# Altium schematic sheet Rotary Encoder.SchDoc: ROTARY ENCODER
size 431 x 279 mm; Date: 02/07/2022; ApprovedBy: RTZ,HYW; CheckedBy: RTZ,HYW; Author: RTZ,HYW; CompanyName: Upenn; DrawnBy: RTZ,HYW; Engineer: RTZ,HYW; Organization: Upenn ESE; Address1: Electrical Engineering; Address2: 200 South 33rd St; Address3: Philadelphia; Address4: PA, 19104; SheetNumber: 6; SheetTotal: 11; ENG_APP_DATE: 02/15/22; DSN_APP_DATE: 02/15/22; CHK_APP_DATE: 02/15/22; DOC_NO_ASSY_DWG: TBD; DOC_NO_FAB_DWG: TBD; PCB_DWG_NO: TBD; Project: SimonSayGame; DESIGN_ITEM: 1.0; CAGE_CODE: TBD; DOC_NO_SCH_DWG: TBD; SCH_SCALE: NA; Time: 13:18
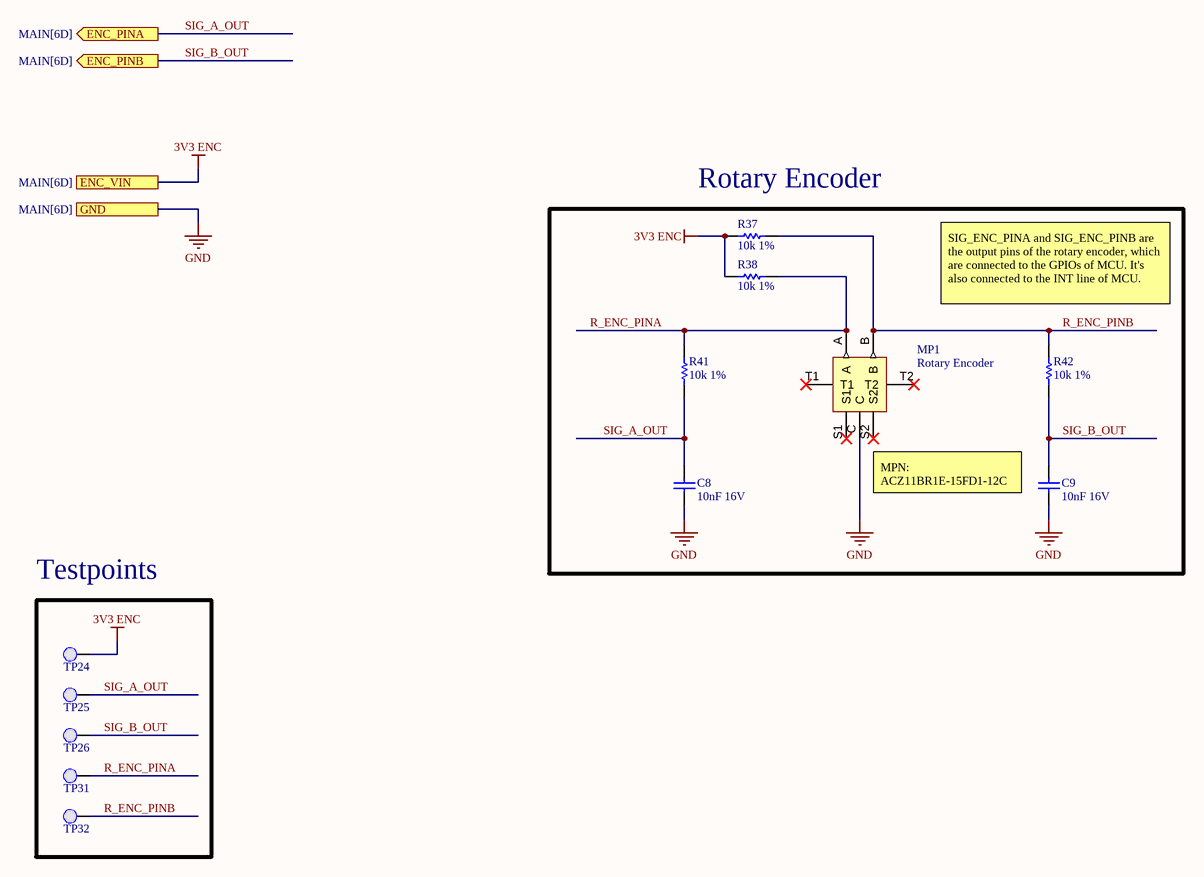
[diagram p0: Rotary Encoder.SchDoc]

## Parts
C8  10nF 16V  [CAPC1608X90]
C9  10nF 16V  [CAPC1608X90]
MP1  Rotary Encoder  [Rotary Encoder]
R37  10k 1%  [RESC1608X55X25ML10T15]
R38  10k 1%  [RESC1608X55X25ML10T15]
R41  10k 1%  [RESC1608X55X25ML10T15]
R42  10k 1%  [RESC1608X55X25ML10T15]
TP24  0.1" Pad  [PCBComponent]  (value not drawn)  (no BOM)
TP25  0.1" Pad  [PCBComponent]  (value not drawn)  (no BOM)
TP26  0.1" Pad  [PCBComponent]  (value not drawn)  (no BOM)
TP31  0.1" Pad  [PCBComponent]  (value not drawn)  (no BOM)
TP32  0.1" Pad  [PCBComponent]  (value not drawn)  (no BOM)

## Blocks framed on the sheet
Rotary Encoder: C8 C9 MP1 R37 R38 R41 R42
Testpoints: TP24-TP26 TP31 TP32

## Ports
ENC_PINA (out, see MAIN[6D]), ENC_PINB (out, see MAIN[6D]), ENC_VIN (see MAIN[6D]), GND (see MAIN[6D])

## Nets
3V3 ENC: R37.2 R38.2 TP24.1(PAD) ; port ENC_VIN
GND: C8.1 C9.1 MP1.C ; port GND
R_ENC_PINA: MP1.A R38.1 R41.2 TP31.1(PAD)
R_ENC_PINB: MP1.B R37.1 R42.2 TP32.1(PAD)
SIG_A_OUT: C8.2 R41.1 TP25.1(PAD) ; port ENC_PINA
SIG_B_OUT: C9.2 R42.1 TP26.1(PAD) ; port ENC_PINB

Not connected (* = marked no-connect by the designer): MP1 S1* S2* T1* T2*

## Notes on the sheet
- SIG_ENC_PINA and SIG_ENC_PINB are the output pins of the rotary encoder, which are connected to the GPIOs of MCU. It's also connected to the INT line of MCU.
  The SIG_A_OUT and SIG_B_OUT can be connected to the oscilloscope for test.
- MPN: ACZ11BR1E-15FD1-12C
- DWG. NO.
- REV.
- SHT.
- THIS DOCUMENT AND THE DATA DISCLOSED HEREIN OR HEREWITH IS THE PROPERTY OF ALTIUM LIMITED AND MAY BE FREELY DISTRIBUTED IN WHOLE. NO RIGHTS ARE RESERVED OR EXPRESS OR IMPLIED WARANTEE GIVEN.
- REVISION
- DESCRIPTION
- DATE
- APPROVED
- ENG:
- APPROVALS
- PROJECT
- DSN:
- CHK:
- REFERENCE DOCUMENTS
- PROJECT REVISION:
- TITLE
- DOCUMENT REVISION:
- DESIGN ITEM:
- BOM:
- FAB DWG:
- PCB DWG:
- ASSY DWG:
- SCALE:
- SIZE
- B
- CAGE CODE
- FILE NAME
- DWG NO.
- SHEET
- OF
- REV

## Library data of the parts
C8 C9 = C0603C103K4REC7867: Rotary Enc-Cap Cer 0603 10NF 16V X7R 10%; Manufacturer: KEMET; Supplier 1: Digi-Key; Supplier Part Number 1: 399-C0603C103K4REC7867CT-ND; Manufacturer Part Number: C0603C103K4REC7867; RoHS: No; Category: Ceramic Capacitors; Stock 1: 907; Pricing 1: 1=0.12000, 10=0.08800, 50=0.04820, 100=0.03930, 500=0.02810, 1000=0.02208 (USD)
MP1 = Rotary Encoder: MPN: ACZ11BR1E-15FD1-12C
R37 R38 R41 R42 = CMP-2000-04877-1: AF0603FR-0710KL; Manufacturer: Yageo; Part Number: AF0603FR-0710KL
TP24-TP26 TP31 TP32 = 0.1" Pad-A.4